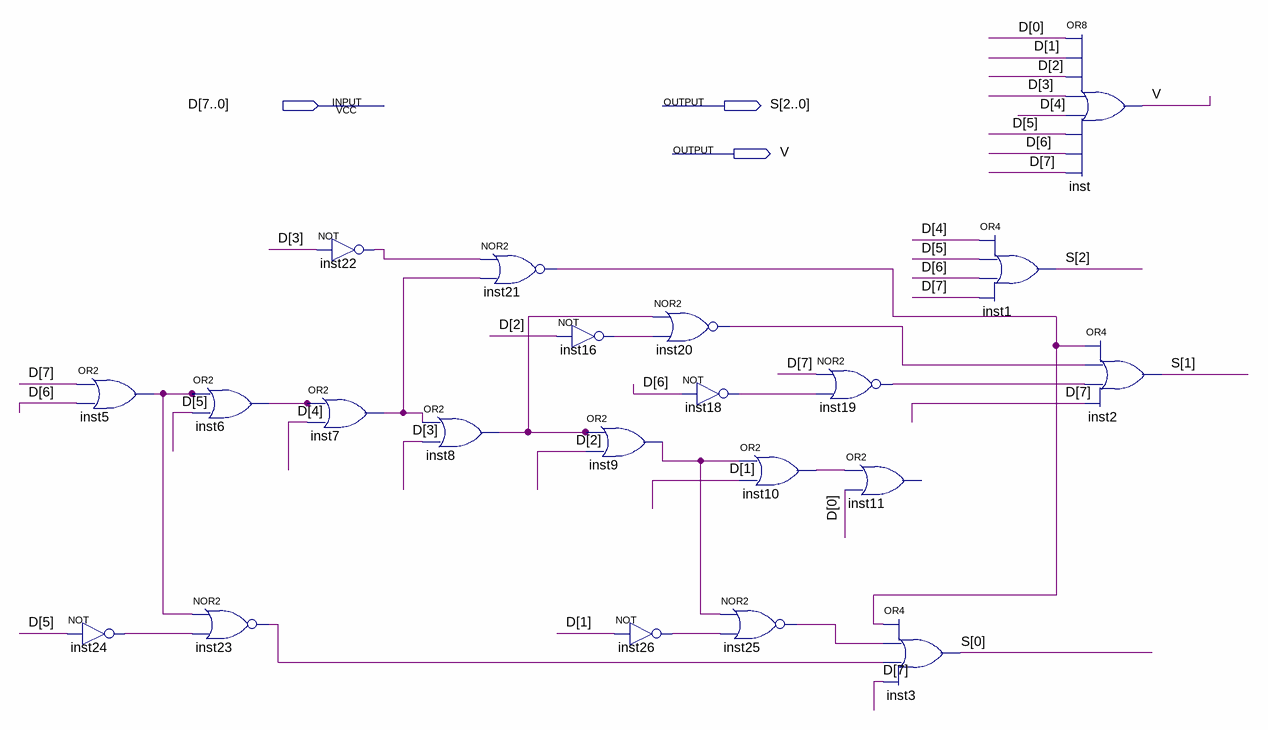
[diagram p0: schematic sheet]
// Quartus schematic LAB03.bdf as structural Verilog: 21 symbols, 3 pins
module LAB03 (
  input  [7:0] D,
  output [2:0] S,
  output V
);

  wire inst5_out, inst6_out, inst7_out, inst8_out, inst9_out, inst10_out, inst16_out, inst18_out, inst19_out,
       inst20_out, inst21_out, inst22_out, inst23_out, inst24_out, inst25_out, inst26_out;

  or inst5 (inst5_out, D[7], D[6]);
  not inst24 (inst24_out, D[5]);
  or inst6 (inst6_out, inst5_out, D[5]);
  nor inst23 (inst23_out, inst5_out, inst24_out);
  not inst22 (inst22_out, D[3]);
  or inst7 (inst7_out, inst6_out, D[4]);
  or inst8 (inst8_out, inst7_out, D[3]);
  nor inst21 (inst21_out, inst22_out, inst7_out);
  not inst16 (inst16_out, D[2]);
  or inst9 (inst9_out, inst8_out, D[2]);
  nor inst20 (inst20_out, inst8_out, inst16_out);
  not inst26 (inst26_out, D[1]);
  not inst18 (inst18_out, D[6]);
  or inst10 (inst10_out, inst9_out, D[1]);
  nor inst25 (inst25_out, inst9_out, inst26_out);
  nor inst19 (inst19_out, D[7], inst18_out);
  // OR2 inst11 has open pins: IN1=inst10_out, IN2=D[0], OUT=open
  or inst3 (S[0], inst21_out, inst25_out, inst23_out, D[7]);
  or inst1 (S[2], D[4], D[5], D[6], D[7]);
  or inst (V, D[0], D[1], D[2], D[3], D[4], D[5], D[6], D[7]);
  or inst2 (S[1], inst21_out, inst20_out, inst19_out, D[7]);
endmodule
